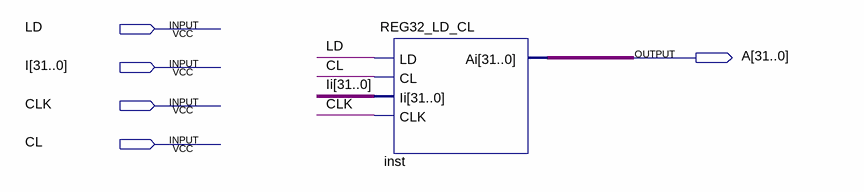
[diagram p0: schematic sheet]
// Quartus schematic IR.bdf as structural Verilog: 1 symbols, 5 pins
module IR (
  input  LD,
  input  [31:0] I,
  input  CLK,
  input  CL,
  output [31:0] A
);

  wire [31:0] Ii;

  REG32_LD_CL inst (.LD(LD), .CL(CL), .Ii(Ii), .CLK(CLK), .Ai(A));
endmodule
